# Altium schematic sheet Relays.SchDoc
size A4
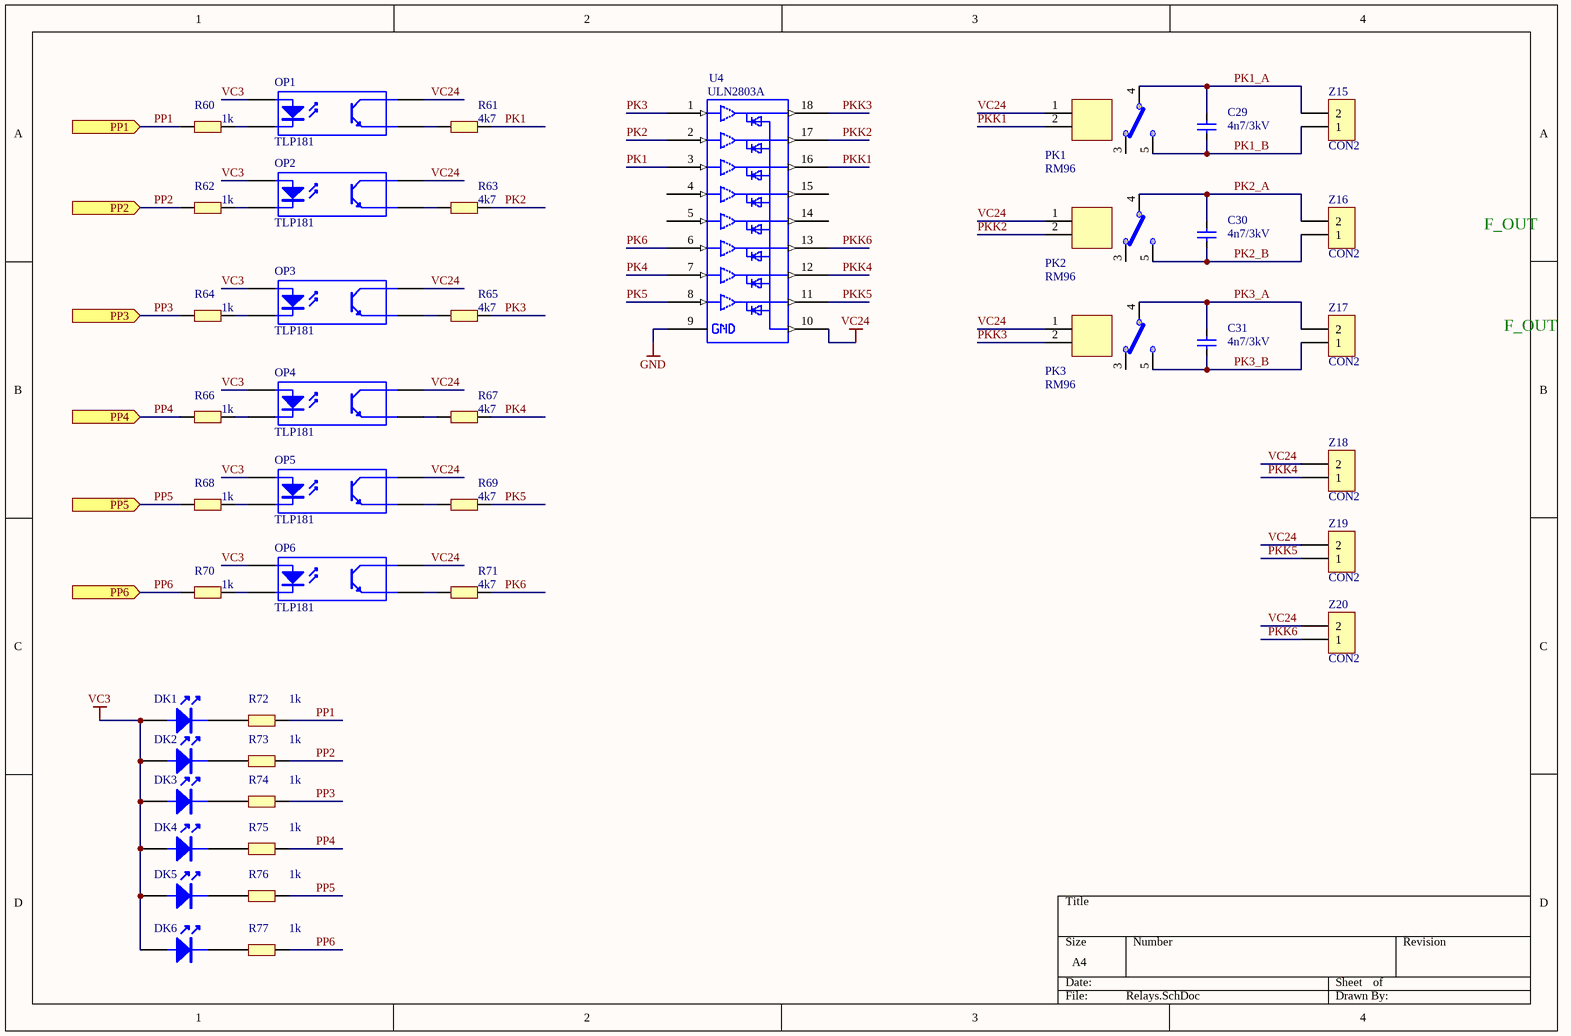
[diagram p0: Relays.SchDoc]

## Parts
C29  4n7/3kV  [CAP_75]
C30  4n7/3kV  [CAP_75]
C31  4n7/3kV  [CAP_75]
DK1  (no value)  [0805LR]
DK2  (no value)  [0805LR]
DK3  (no value)  [0805LR]
DK4  (no value)  [0805LR]
DK5  (no value)  [0805LR]
DK6  (no value)  [0805LR]
OP1  TLP181  [TLP181_1]
OP2  TLP181  [TLP181_1]
OP3  TLP181  [TLP181_1]
OP4  TLP181  [TLP181_1]
OP5  TLP181  [TLP181_1]
OP6  TLP181  [TLP181_1]
PK1  RM96  [RM96A]
PK2  RM96  [RM96A]
PK3  RM96  [RM96A]
R60  1k  [0805R]
R61  4k7  [0805R]
R62  1k  [0805R]
R63  4k7  [0805R]
R64  1k  [0805R]
R65  4k7  [0805R]
R66  1k  [0805R]
R67  4k7  [0805R]
R68  1k  [0805R]
R69  4k7  [0805R]
R70  1k  [0805R]
R71  4k7  [0805R]
R72  1k  [0805R]
R73  1k  [0805R]
R74  1k  [0805R]
R75  1k  [0805R]
R76  1k  [0805R]
R77  1k  [0805R]
U4  ULN2803A  [SO-18]
Z15  CON2  [ARC-L-2-5.08]
Z16  CON2  [ARC-L-2-5.08]
Z17  CON2  [ARC-L-2-5.08]
Z18  CON2  [ARC-L-2-5.08]
Z19  CON2  [ARC-L-2-5.08]
Z20  CON2  [ARC-L-2-5.08]

## Ports
PP1 (in), PP2 (in), PP3 (in), PP4 (in), PP5 (in), PP6 (in)

## Nets
GND: U4.9
VC3: DK1.A DK2.A DK3.A DK4.A DK5.A DK6.A OP1.1 OP2.1 OP3.1 OP4.1 OP5.1 OP6.1
VC24: OP1.4 OP2.4 OP3.4 OP4.4 OP5.4 OP6.4 PK1.1 PK2.1 PK3.1 U4.10 Z18.2 Z19.2 Z20.2
PK1: R61.2 U4.3
PK1_A: C29.2 PK1.4 Z15.2
PK1_B: C29.1 PK1.5 Z15.1
PK2: R63.2 U4.2
PK2_A: C30.2 PK2.4 Z16.2
PK2_B: C30.1 PK2.5 Z16.1
PK3: R65.2 U4.1
PK3_A: C31.2 PK3.4 Z17.2
PK3_B: C31.1 PK3.5 Z17.1
PK4: R67.2 U4.7
PK5: R69.2 U4.8
PK6: R71.2 U4.6
PKK1: PK1.2 U4.16
PKK2: PK2.2 U4.17
PKK3: PK3.2 U4.18
PKK4: U4.12 Z18.1
PKK5: U4.11 Z19.1
PKK6: U4.13 Z20.1
PP1: R60.1 R72.2 ; port PP1
PP2: R62.1 R73.2 ; port PP2
PP3: R64.1 R74.2 ; port PP3
PP4: R66.1 R75.2 ; port PP4
PP5: R68.1 R76.2 ; port PP5
PP6: R70.1 R77.2 ; port PP6
NetDK1_K: DK1.K R72.1
NetDK2_K: DK2.K R73.1
NetDK3_K: DK3.K R74.1
NetDK4_K: DK4.K R75.1
NetDK5_K: DK5.K R76.1
NetDK6_K: DK6.K R77.1
NetOP1_2: OP1.2 R60.2
NetOP1_3: OP1.3 R61.1
NetOP2_2: OP2.2 R62.2
NetOP2_3: OP2.3 R63.1
NetOP3_2: OP3.2 R64.2
NetOP3_3: OP3.3 R65.1
NetOP4_2: OP4.2 R66.2
NetOP4_3: OP4.3 R67.1
NetOP5_2: OP5.2 R68.2
NetOP5_3: OP5.3 R69.1
NetOP6_2: OP6.2 R70.2
NetOP6_3: OP6.3 R71.1

Not connected (* = marked no-connect by the designer): PK1 3; PK2 3; PK3 3; U4 4 5 14 15

## Notes on the sheet
- F_OUT

## Library data of the parts
C29-C31 = CAP
DK1-DK6 = LED
OP1-OP6 = TLP621: Optoisolator
R60-R77 = RES3
U4 = Pro31.tmp_ULN2803A_42
Z15-Z20 = CON2: Connector